# Altium schematic sheet H05R1_Frontend_2.SchDoc
size Letter; CompanyName: Hexabitz; DocumentNumber: 3; SheetNumber: 3; SheetTotal: 3
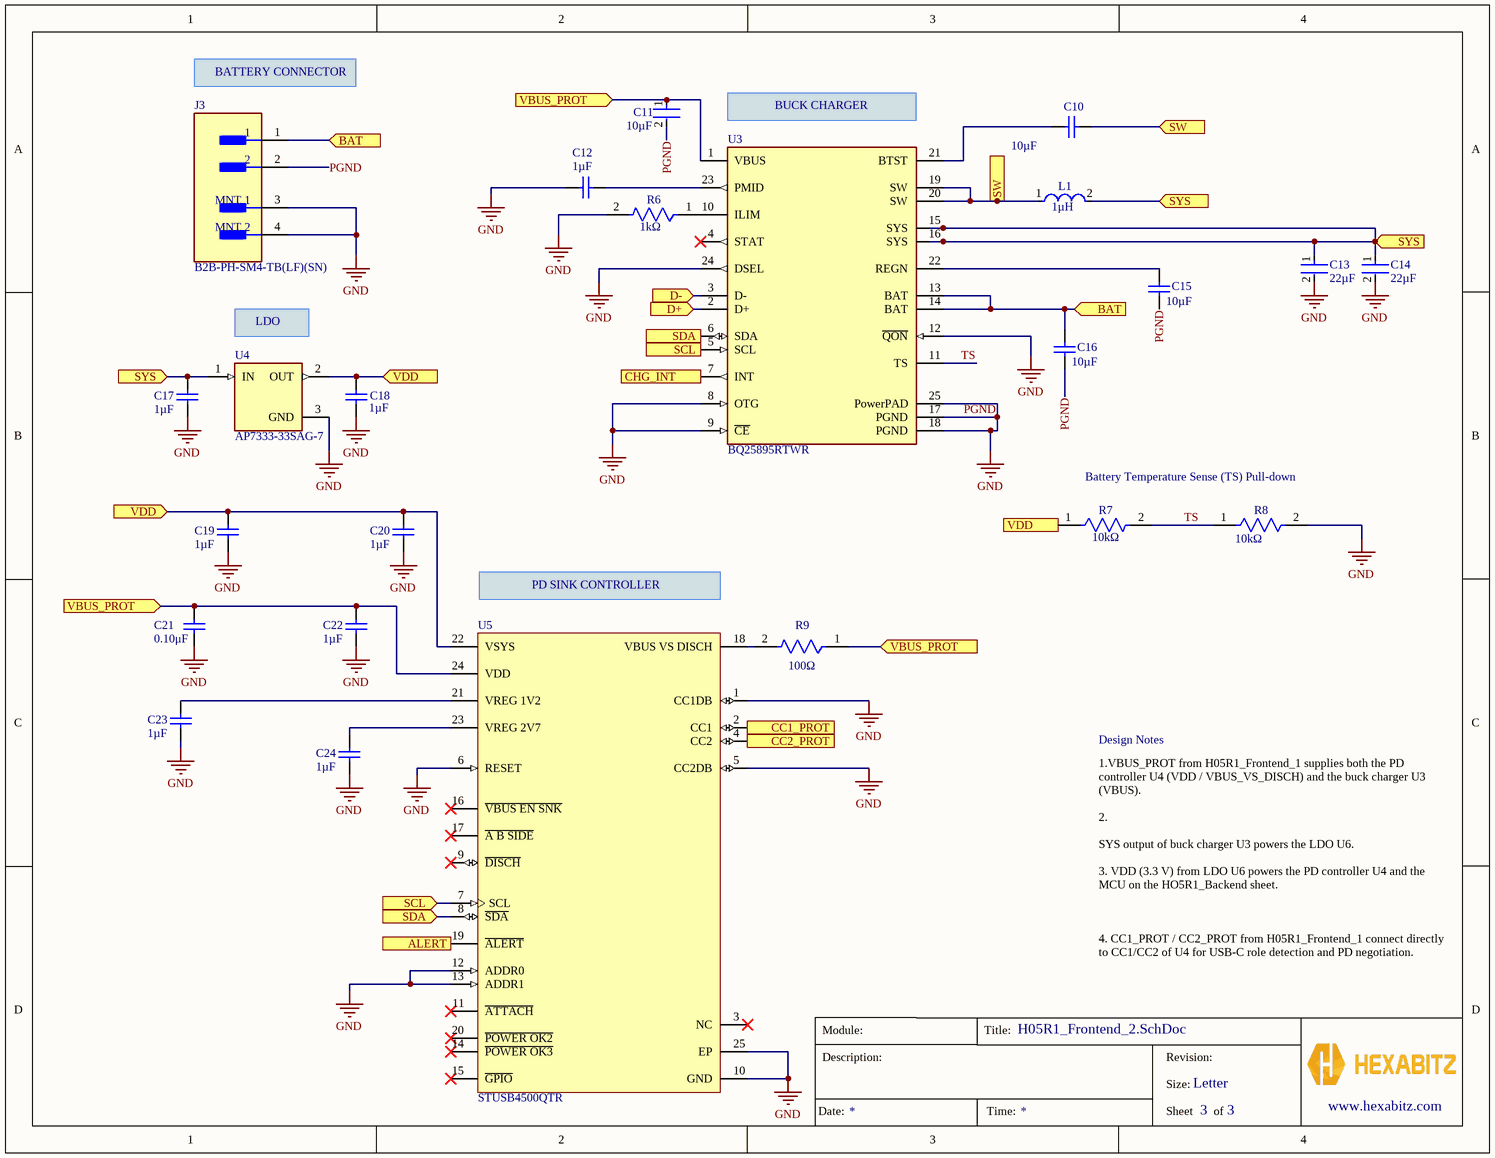
[diagram p0: H05R1_Frontend_2.SchDoc]

## Parts
C10  10µF  [CAPC1608X90X35ML10T15]
C11  10µF  [FP-GRM21B-0_2-e0_2_0_7-IPC_B]
C12  1µF  [CAPC1608X90X35ML10T15]
C13  22µF  [FP-GRM21B-0_15-MFG]
C14  22µF  [FP-GRM21B-0_15-MFG]
C15  10µF  [CAPC1608X90X35ML10T15]
C16  10µF  [CAPC2013X135X45ML10T25]
C17  1µF  [CAPC1608X90X35ML10T15]
C18  1µF  [CAPC1608X90X35ML10T15]
C19  1µF  [MURA-0603_H_0.9_M]
C20  1µF  [CAPC1608X90X35ML10T15]
C21  0.10μF  [CAPC1608X90X35LL10T15]
C22  1µF  [CAPC1608X90X35ML10T15]
C23  1µF  [CAPC1608X90X35ML10T15]
C24  1µF  [CAPC1608X90X35ML10T15]
J3  B2B-PH-SM4-TB(LF)(SN)  [FP-B2B-PH-SM4-TB_LF_SN-MFG]
L1  1µH  [FP-XAL4020-102MEC-MFG]
R6  1kΩ  [FP-RC0603-0_55-IPC_C]
R7  10kΩ  [FP-RC0603-0_55-IPC_C]
R8  10kΩ  [FP-RC0603-0_55-IPC_C]
R9  100Ω  [FP-RC0603-0_55-MFG]
U3  BQ25895RTWR  [FP-RTW0024H-IPC_B]
U4  AP7333-33SAG-7  [FP-SOT23-MFG]
U5  STUSB4500QTR  [FP-QFN-24-EP_4x4-MFG]

## Ports
ALERT (in), BAT (in), CC1_PROT (in), CC2_PROT (in), CHG_INT (in), D+ (in), D- (in), SCL (in), SDA (in), SW (in), SYS (in), VBUS_PROT (in), VDD (in)

## Nets
PGND: C11.2 C12.1 C13.2 C14.2 C15.1 C16.1 C17.1 C18.1 C19.1 C20.1 C21.1 C22.1 C23.1 C24.1 J3.2 J3.3(MNT_1) J3.4(MNT_2) R6.2 R8.2 U3.8(OTG) U3.9(~{CE}) U3.12(~{QON}) U3.17(PGND) U3.18(PGND) U3.24(DSEL) U3.25(PowerPAD) U4.3(GND) U5.1(CC1DB) U5.5(CC2DB) U5.6(RESET) U5.10(GND) U5.12(ADDR0) U5.13(ADDR1) U5.25(EP)  [also labelled GND]
ALERT: U5.19(~{ALERT}) ; port ALERT
BAT: C16.2 J3.1 U3.13(BAT) U3.14(BAT) ; port BAT
CC1_PROT: U5.2(CC1) ; port CC1_PROT
CC2_PROT: U5.4(CC2) ; port CC2_PROT
CHG_INT: U3.7(INT) ; port CHG_INT
D+: U3.2(D+) ; port D+
D-: U3.3(D-) ; port D-
SCL: U3.5(SCL) U5.7(SCL) ; port SCL
SDA: U3.6(SDA) U5.8(~{SDA}) ; port SDA
SW: C10.1 L1.1 U3.19(SW) U3.20(SW) ; port SW
SYS: C13.1 C14.1 C17.2 L1.2 U3.15(SYS) U3.16(SYS) U4.1(IN) ; port SYS
TS: R7.2 R8.1 U3.11(TS)
VBUS_PROT: C11.1 C21.2 C22.2 R9.1 U3.1(VBUS) U5.24(VDD) ; port VBUS_PROT
VDD: C18.2 C19.2 C20.2 R7.1 U4.2(OUT) U5.22(VSYS) ; port VDD
NetC10_2: C10.2 U3.21(BTST)
NetC12_2: C12.2 U3.23(PMID)
NetC15_2: C15.2 U3.22(REGN)
NetC23_2: C23.2 U5.21(VREG_1V2)
NetC24_2: C24.2 U5.23(VREG_2V7)
NetR6_1: R6.1 U3.10(ILIM)
NetR9_2: R9.2 U5.18(VBUS_VS_DISCH)

Not connected (* = marked no-connect by the designer): U3 4(STAT)*; U5 3(NC)* 9(~{DISCH})* 11(~{ATTACH})* 14(~{POWER_OK3})* 15(~{GPIO})* 16(~{VBUS_EN_SNK})* 17(~{A_B_SIDE})* 20(~{POWER_OK2})*

## Notes on the sheet
- BATTERY CONNECTOR
- (near U3) BUCK CHARGER
- (near U4) LDO
- Battery Temperature Sense (TS) Pull-down
- PD SINK CONTROLLER
- Design Notes
- 1.VBUS_PROT from H05R1_Frontend_1 supplies both the PD controller U4 (VDD / VBUS_VS_DISCH) and the buck charger U3 (VBUS).
  2.
  SYS output of buck charger U3 powers the LDO U6.
  3. VDD (3.3 V) from LDO U6 powers the PD controller U4 and the MCU on the HO5R1_Backend sheet.
  4. CC1_PROT / CC2_PROT from H05R1_Frontend_1 connect directly to CC1/CC2 of U4 for USB-C role detection and PD negotiation.
  5. SDA, SCL, ALERT (U4), and CHG_INT (U3) are routed to the MCU within HO5R1_Backend to enable PD control and charger status monitoring.
- Module:
- Title:
- Description:
- Size:
- Revision:
- Letter
- www.hexabitz.com
- Date:
- Time:
- Sheet
- of

## Library data of the parts
C10 = CMP-2006-02858-1: Ceramic Capacitor, Multilayer, Ceramic, 25V, 10% +Tol, 10% -Tol, X7R, 15% TC, 10uF, Surface Mount, 0805; Part Number: GRM188R71C473KA01D; Manufacturer: Murata; Octopart: https://octopart.com/part/murata/GRM21BZ71E106KE15L
C11 = CMP-06035-047417-1: Chip Multilayer Ceramic Capacitors for General Purpose, 0805, 10uF, X7R, 15%, 10%, 25V; MPN: GRM21BZ71E106KE15L; MFN: Murata; Parameter 1: https://octopart.com/part/murata/GRM21BZ71E106KE15L
C12 = CMP-2006-02845-1: Ceramic Capacitor, Ceramic, 16V, 10% +Tol, 10% -Tol, X7R, 15% TC, 1uF, Surface Mount, 0603 / Series: Murata - Chip Monolithic Ceramic Capacitors; Part Number: GRM188R71C105KA12D; Manufacturer: Murata; Octopart: https://octopart.com/search?q=GRM188R71C105KA12D&currency=USD&specs=0
C13 C14 = CMP-2007-03385-2: Chip Multilayer Ceramic Capacitors for General Purpose, 0805, 22uF, X5R, 15%, 20%, 6.3V; MPN: GRM21BR60J226ME39L; MFN: Murata; Material: Ceramic; Max Operating Temperature: 85°C; Voltage: 6.3V; Min Operating Temperature: -55°C; Case/Package: 0805; Thickness: 0.053inch; Dielectric: X5R; Packaging: Tape and Reel; Depth: 1.25mm; Termination: SMD/SMT; Voltage Rating (DC): 6.3V; Radiation Hardening: No; Tolerance: 20%; Mount: Surface Mount; Lead Free: Lead Free; Package Quantity: 1; REACH SVHC: No SVHC; Voltage Rating: 6.3V; Capacitance: 22uF; Length: 2mm; Case Code (Imperial): 0805; Case Code (Metric): 2012; Width: 0.049inch; Height: 1.25mm; Octopart: https://octopart.com/part/murata/GRM21BR60J226ME39L
C15 = CMP-2006-02845-1: Ceramic Capacitor, Multilayer, Ceramic, 25V, 10% +Tol, 10% -Tol, X7R, 15% TC, 10uF, Surface Mount, 0805; Manufacturer: Murata; Part Number: GRM188R71C105KA12D; Octopart: https://octopart.com/part/murata/GRM21BZ71E106KE15L
C16 = CMP-2007-03529-1: Multilayer Ceramic Capacitors MLCC Surface Mount 0805 10uF 6.3 Volts X5R; Part Number: GRM21BR60J106KE19L; Manufacturer: Murata; Octopart: https://octopart.com/search?q=GRM21BR60J106KE19L&currency=USD&specs=0
C17 C18 C20 = CMP-2006-02845-1: Ceramic Capacitor, Ceramic, 16V, 10% +Tol, 10% -Tol, X7R, 15% TC, 1uF, Surface Mount, 0603; Manufacturer: Murata; Part Number: GRM188R71C105KA12D; Octopart: https://octopart.com/part/murata/GRM188R71C105KA12D
C19 = CMP-2000-05253-1: CAP, Ceramic, 0.1 uF, 10%, 16 V, 0603, RoHS, Tape and Reel; Manufacturer: Murata; MPN: GRM188R71C104KA01D; Capacitance - pF: 100000pF; Case Length: 1.6mm; Voltage Rating DC: 16V; Brand: MurataElectronics; Temperature Coefficient / Code: +/-15%; Case Width: 0.8mm; Type: GeneralPurposeMLCC; Capacitance: 0.1uF; Dielectric: X7R; Capacitance - nF: 100nF; Product Category: MultilayerCeramicCapacitorsMLCC-SMD/SMT; Datasheet URL: https://datasheet.ciiva.com/29202/451467-da-01-en-vs-kondensator-0603-29202287.pdf; Termination Style: SMD/SMT; Operating Temperature Range: -55Cto+125C; Case Code - in: 0603; Datasheet Version: Dec-10; Dimensions: 0.8mmWx1.6mmLx0.8mmH; RoHS: Details; Case Code - mm: 1608; Product: GeneralTypeMLCCs; Voltage Rating: 16V; Package / Case: 0603(1608metric); Factory Pack Quantity: 4000; Packaging: Reel; Maximum Operating Temperature: +125C; Manufacturer URL: http://www.murata.com/; Case Height: 0.8mm; Minimum Operating Temperature: -55C; Series: GRM; Tolerance: 10%; Octopart: https://octopart.com/part/murata/GRM188R71C104KA01D
C21 = CMP-2006-02868-1: 25V 100Nf X7R 10% 0603 Multilayer Ceramic Capacitors Mlcc Smd/Smt Rohs; Part Number: GRM188R71E104KA01D; Manufacturer: Murata
C22 = CMP-2006-02460-1: Manufacturer: Murata; Part Number: GRM188R71E105KA12D; Octopart: https://octopart.com/part/murata/GRM188R71E105KA12D
C23 C24 = CMP-2006-02460-1: Ceramic Capacitor, Ceramic, 25V, 10% +Tol, 10% -Tol, X7R, 15% TC, 1uF, Surface Mount, 0603; Manufacturer: Murata; Part Number: GRM188R71E105KA12D; Octopart: https://octopart.com/part/murata/GRM188R71E105KA12D
J3 = CMP-2000-05163-2: CONN HEADER SMD 2POS 2MM; Number of Poles: 2; Max Current Rating: 2A; Gender: Male; Working Voltage: 100V; Mated Stacking Heights: 8.6mm; Contact Resistance: 20mR; Insulation Resistance: 1GR; MFN: JST; Number of Contacts: 2; Housing Material: Polyamide; Lead Pitch: 2mm; Packaging: Tape and Reel; Fastening Type: Detent; Contact Finish - Mating: TIN; Width: 5.5mm; Min Operating Temperature: -25°C; Mount: Surface Mount; Current Rating: 2A; Pitch: 2mm; REACH SVHC: No SVHC; Flammability Rating: UL94 V-0; Contact Plating: Tin; Voltage Rating (AC): 100V; Length: 7.95mm; Number of Rows: 1; Max Operating Temperature: 85°C; Connector Type: Header; Height: 9.4mm; Insulation Material: Nylon; Depth: 5mm; Color: White; Termination: Solder; Housing Color: Beige; Contact Mating Length: 0.13inch; Contact Material: Copper Alloy; Orientation: Straight; Contact Type: Male Pin; Lead Free: Lead Free; Voltage Rating: 100V; Series: PH; Number of Positions: 2; Contact Shape: Square; Max Voltage Rating (AC): 100V; Insulation Color: Natural; Octopart: https://octopart.com/part/jst/B2B-PH-SM4-TB%28LF%29%28SN%29; MPN: B2B-PH-SM4-TB(LF)(SN)
L1 = CMP-11268-000037-1: Fixed Inductors 1uH 20% 9.6A 14.60mOhms AEC-Q200; Manufacturer: Coilcraft; Manufacturer Part Number: XAL4020-102MEC; Saturation Current: 8.7A; Core Material: Composite; Test Frequency: 1MHz; Standoff Height: 0.1mm; Shielding: true; Automotive Grade: Grade 1; Self Resonant Frequency: 79MHz; Series Resistance: 14.6mΩ; Rms Current: 9.6A; Category: Ind; RoHS: TRUE; Device Class L2: Inductors; Mouser Description: Power inductor, shielded, 20% tol, SMT, RoHS, halogen f; Lead Free: Yes; Device Class L1: Passive Components; Inductance: 1uH; ComponentLink2URL: https://www.coilcraft.com/pdfs/xal4000.pdf; Height: 2.1mm; Device Class L3: Fixed Inductors; Composition: Wirewound; Package: 0; Ambient Temperature Range Low: -40°C; Automotive: Yes; Ambient Temperature Range High: +125°C; ComponentLink2Description: Datasheet; Octopart: https://octopart.com/xal4020-102mec-coilcraft-13142161; Tolerance: 20%; Value: 1uH
R6 = CMP-1659-00009-5: RES 1K OHM 1% 1/10W 0603; MPN: RC0603FR-071KL; Resistance: 1kR; Voltage Rating: 50V; Power Rating: 100mW; Temperature Coefficient: 100ppm/°C; MFN: Yageo Group; Military Standard: Not; REACH SVHC: No SVHC; Size Code: 0603; Features: Moisture Resistant; Number of Terminations: 2; Technology: THICK FILM; Series: RC; Case Code (Metric): 1608; Resistance Tolerance: 1%; Resistor Type: Thick Film; Termination: SMD/SMT; Contact Plating: Tin; Radiation Hardening: No; Min Operating Temperature: -55°C; Max Operating Temperature: 155°C; Packaging: Tape and Reel; Max Power Dissipation: 100mW; RoHS Compliant: Yes; Height: 0.45mm; Lead Free: Lead Free; Case/Package: 0603; Length: 1.6mm; Tolerance: 1%; Case Code (Imperial): 0603; Construction: Rectangular; Depth: 0.8mm
R7 R8 = CMP-2100-03664-2: RES 10K OHM 1% 1/10W 0603; MPN: RC0603FR-0710KL; Voltage Rating: 75V; Voltage Rating (DC): 50V; Resistance: 10kR; Power Rating: 100mW; Temperature Coefficient: 100ppm/°C; MFN: Yageo Group; Depth: 0.8mm; Termination: SMD/SMT; Resistor Type: Thick Film; Series: RC; Construction: Rectangular; Features: Moisture Resistant; Packaging: Tape and Reel; Min Operating Temperature: -55°C; Number of Terminations: 2; Lead Pitch: 0.3mm; RoHS Compliant: Yes; Case/Package: 0603; Resistance Tolerance: 1%; Military Standard: Not; Weight: 7.1E-05oz; Number of Pins: 2; Tolerance: 1%; Length: 1.6mm; Case Code (Imperial): 0603; Lead Free: Lead Free; Width: 0.8mm; Max Power Dissipation: 100mW; Height: 0.45mm; Max Operating Temperature: 155°C; Case Code (Metric): 1608; Size Code: 0603; Octopart: https://octopart.com/search?q=RC0603FR-0710KL&currency=USD&specs=0
R9 = CMP-2100-03663-2: NexarPartId: 55402879; MPN: RC0603FR-07100RL; Voltage Rating: 50V; Power Rating: 100mW; Tolerance: 1%; Temperature Coefficient: 100ppm/°C; MFN: Yageo Group; Case/Package: 0603; Military Standard: Not; REACH SVHC: Unknown; Case Code (Metric): 0603; Max Operating Temperature: 155°C; Schedule B: 8533210045, 8533210045; Height: 450µm; Length: 1.6mm; Lead Free: Lead Free; Packaging: Tape & Reel; Case Code (Imperial): 0603; Composition: Thick Film; Min Operating Temperature: -55°C; Voltage Rating (DC): 50V; RoHS: Compliant; Depth: 800µm; Number of Pins: 2; Termination: SMD/SMT; Width: 800µm; Resistance: 100Ω; Parameter 1: RC0603FR-07100RL
U3 = CMP-04911-000061-1: IC NVDC CHARGER I2C 24WQFN; Output Current: 5A; Number of Cells: 1; Output Voltage: 4.6V; Operating Supply Voltage: 14V; MFN: Texas Instruments; Max Operating Temperature: 85°C; Lead Free: Lead Free; Contact Plating: Gold; RoHS Compliant: Yes; Mount: Surface Mount; Min Operating Temperature: -40°C; MPN: BQ25895RTWR; Octopart: https://octopart.com/bq25895rtwr-texas+instruments-56801238
U4 = CMP-12756-000020-1: IC REG LINEAR 3.3V 300MA SOT23-3; Manufacturer: Diodes Inc.; Number Of Outputs: 1; Max Power Dissipation: 600mW; Max Supply Voltage: 6V; Max Junction Temp: +125°C; Accuracy Percentage: 2%; Dropout Voltage: 300mV; Nominal Supply Current: 55-65uA; Min Supply Voltage: 2V; Output Type: Fixed; Standoff Height: 0.013mm; Ipc Land Pattern Name: SOT92P240X102-3; Output Current: 300mA; Category: IC; Temperature: -40°C to +125°C; Octopart: https://octopart.com/ap7333-33sag-7-diodes+inc.-17947531; Automotive: No; Ambient Temperature Range Low: -40°C; Height: 1.1mm; Lead Free: Yes; Device Class L2: Power Management ICs; Ambient Temperature Range High: +85°C; ComponentLink2Description: Datasheet; Device Class L3: Voltage Regulators - Linear; Mouser Description: AP7333 Series 3.3 V 300 mA SMT Low Dropout Linear Regulator - SOT-23-3; RoHS: TRUE; Footprint Url: https://www.diodes.com/assets/Package-Files/SOT23.pdf; Output Voltage: 3.3V; Device Class L1: Integrated Circuits (ICs); Digikey Description: IC REG LINEAR 3.3V 300MA SOT23-3; Temperature Range High: +125°C; Temperature Range Low: -40°C; Manufacturer Part Number: AP7333-33SAG-7; Package: SOT23; ComponentLink2URL: http://datasheet.octopart.com/AP7333-33SAG-7-Diodes-Inc.-datasheet-11745883.pdf
U5 = CMP-12113-000003-3: 4.1V~22V USB 2.0 I2C Controllers Interface ICs STUSB45 Controller 24-VFQFN Exposed Pad; Number of Ports: 1; Min Supply Voltage: 3V; Max Junction Temperature (Tj): 145°C; Max Supply Voltage: 22V; Interface: I2C, USB; USB Standard: USB 2.0; MFN: STMicroelectronics; Lifecycle Status: Production; Schedule B: 8542390000, 8542390000; Min Operating Temperature: -40°C; Ambient Temperature Range High: 105°C; Max Operating Temperature: 105°C; Height: 1mm; Octopart: https://octopart.com/stusb4500qtr-stmicroelectronics-91765108; MPN: STUSB4500QTR